# Altium schematic sheet usb_connector.SchDoc
size A4
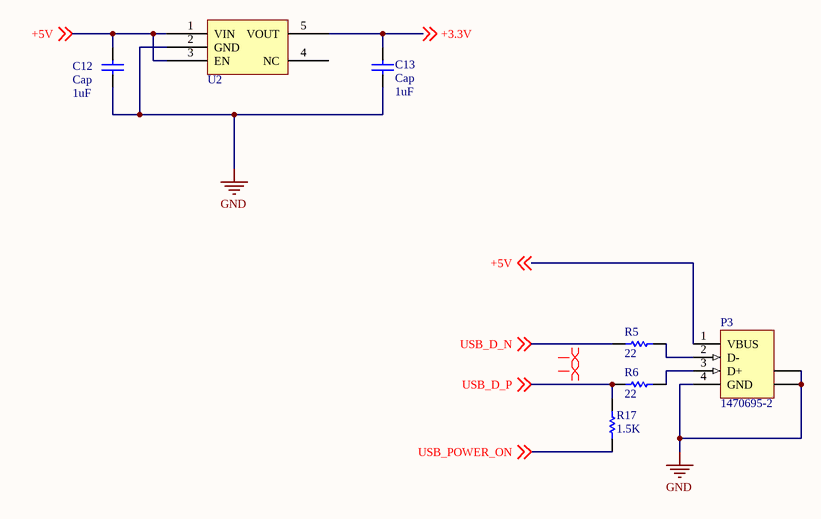
[diagram p0: usb_connector.SchDoc]

## Parts
C12  Cap  value 1uF  [CHIP0402]
C13  Cap  value 1uF  [CHIP0402]
P3  1470695-2  [1470695A]
R5  22  [CHIP0402]
R6  22  [CHIP0402]
R17  1.5K  [CHIP0402]
U2  ADP120  [SOT95P280X110-5L]  (value not drawn)

## Nets
GND: C12.1 C13.1 P3.4(GND) P3.5(SHLD) P3.6(SHLD) U2.2(GND)
+3.3V: C13.2 U2.5(VOUT) ; off-sheet +3.3V
+5V: C12.2 P3.1(VBUS) U2.1(VIN) U2.3(EN) ; off-sheet +5V
USB_D_N: R5.1 ; off-sheet USB_D_N
USB_D_P: R6.1 R17.1 ; off-sheet USB_D_P
USB_POWER_ON: R17.2 ; off-sheet USB_POWER_ON
NetP3_2: P3.2(D-) R5.2
NetP3_3: P3.3(D+) R6.2

Not connected (* = marked no-connect by the designer): U2 4(NC)

## Layout directives
differential pair: (no net found under the mark)

## Library data of the parts
C12 C13 = Cap: Capacitor; Published: 8-Jun-2000; LatestRevisionDate: 17-Jul-2002; LatestRevisionNote: Re-released for DXP Platform.; PackageReference: RAD-0.3; Publisher: Altium Limited; PackageDescription: Radial Cap, Thru-Hole; 2 Leads; 0.3 in Pin Spacing
P3 = 1470695-2: USB 1.1, Right Angle, SMT, A Type, Plug, 4 Position, Natural; ContactMaterial: Brass; ContactPlating: Gold (30) over Nickel (50); PCB_Layout: Complies with manufacturer's recommendation.; DrillSize: Corresponds to nominal value.; PanelGround: Without; Published: 15-Jul-2004; DatasheetDocument: 21-Jan-2003; PackageDocument: 21-Jan-2003; PackageReference: 1470695A; Publisher: Altium Limited; HousingMaterial: Thermoplastic; ComponentLink1Description: Manufacturer Link; ComponentLink1URL: http://www.tycoelectronics.com/; ComponentLink2Description: Packaging Specification; ComponentLink2URL: http://ecommas.tycoelectronics.com/commerce/DocumentDelivery/DDEController?Action=showdoc&DocId=Customer+Drawing%7F1470695%7FO%7Fpdf%7FEnglish%7FC_1470695_O.pdf
R5 R6 R17 = Res1: Resistor; Published: 8-Jun-2000; LatestRevisionDate: 17-Jul-2002; LatestRevisionNote: Re-released for DXP Platform.; PackageReference: AXIAL-0.3; Publisher: Altium Limited; PackageDescription: Axial Device, Thru-Hole; 2 Leads; 0.3 in Pin Spacing
  R5 R6: Value: 22
  R17: Value: 1.5K